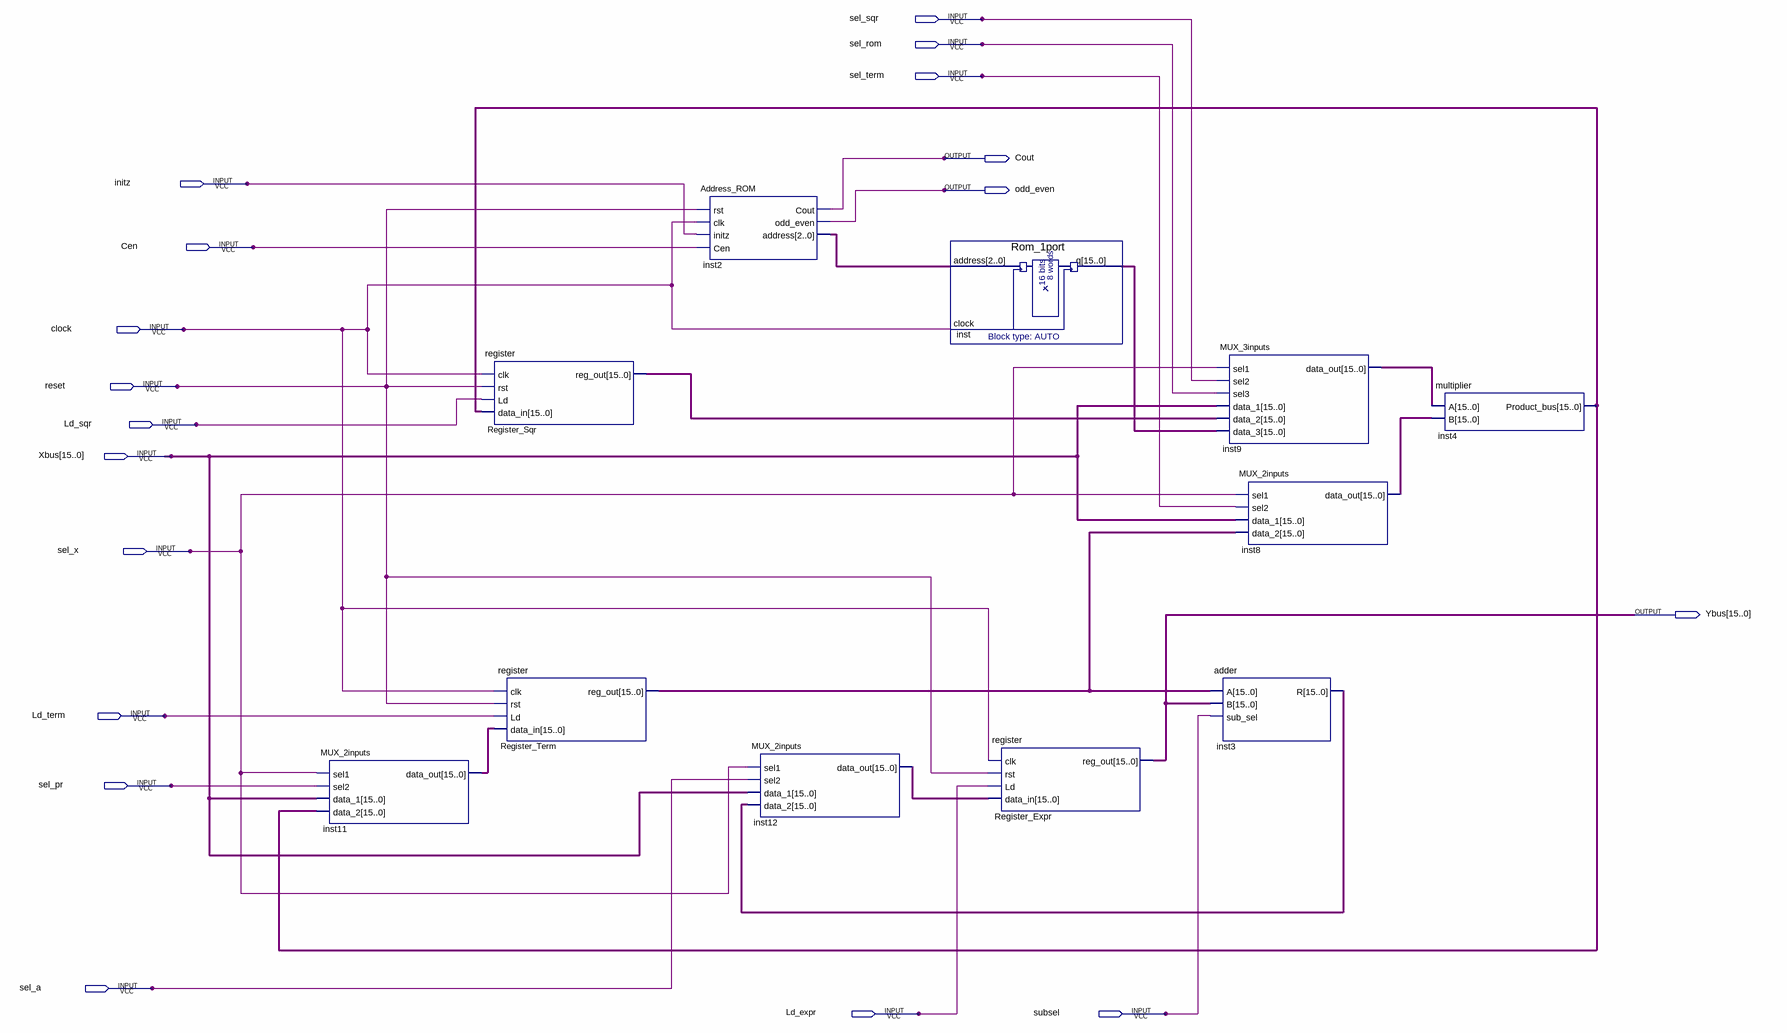
[diagram p0: schematic sheet]
// Quartus schematic datapath_Q.bdf as structural Verilog: 11 symbols, 18 pins
module datapath_Q (
  input  sel_sqr,
  input  sel_rom,
  input  sel_term,
  input  initz,
  input  Cen,
  input  clock,
  input  reset,
  input  Ld_sqr,
  input  [15:0] Xbus,
  input  sel_x,
  input  Ld_term,
  input  sel_pr,
  input  sel_a,
  input  Ld_expr,
  input  subsel,
  output Cout,
  output odd_even,
  output [15:0] Ybus
);

  wire [2:0] inst2_address;
  wire [15:0] inst3_r, inst4_product_bus, inst8_data_out, inst9_data_out, inst11_data_out, inst12_data_out,
       inst_q, Register_Sqr_reg_out, Register_Term_reg_out;

  MUX_2inputs inst11 (
    .sel1(sel_x), .sel2(sel_pr), .data_1(Xbus), .data_2(inst4_product_bus), .data_out(inst11_data_out));
  register Register_Sqr (
    .clk(clock), .rst(reset), .Ld(Ld_sqr), .data_in(inst4_product_bus), .reg_out(Register_Sqr_reg_out));
  register Register_Term (
    .clk(clock), .rst(reset), .Ld(Ld_term), .data_in(inst11_data_out), .reg_out(Register_Term_reg_out));
  Address_ROM inst2 (
    .rst(reset), .clk(clock), .initz(initz), .Cen(Cen), .Cout(Cout), .odd_even(odd_even),
    .address(inst2_address));
  MUX_2inputs inst12 (.sel1(sel_x), .sel2(sel_a), .data_1(Xbus), .data_2(inst3_r), .data_out(inst12_data_out));
  Rom_1port inst (.address(inst2_address), .clock(clock), .q(inst_q));
  register Register_Expr (.clk(clock), .rst(reset), .Ld(Ld_expr), .data_in(inst12_data_out), .reg_out(Ybus));
  MUX_3inputs inst9 (
    .sel1(sel_x), .sel2(sel_sqr), .sel3(sel_rom), .data_1(Xbus), .data_2(Register_Sqr_reg_out),
    .data_3(inst_q), .data_out(inst9_data_out));
  adder inst3 (.A(Register_Term_reg_out), .B(Ybus), .sub_sel(subsel), .R(inst3_r));
  MUX_2inputs inst8 (
    .sel1(sel_x), .sel2(sel_term), .data_1(Xbus), .data_2(Register_Term_reg_out), .data_out(inst8_data_out));
  multiplier inst4 (.A(inst9_data_out), .B(inst8_data_out), .Product_bus(inst4_product_bus));
endmodule
